# Altium project pca63550.PrjPCB
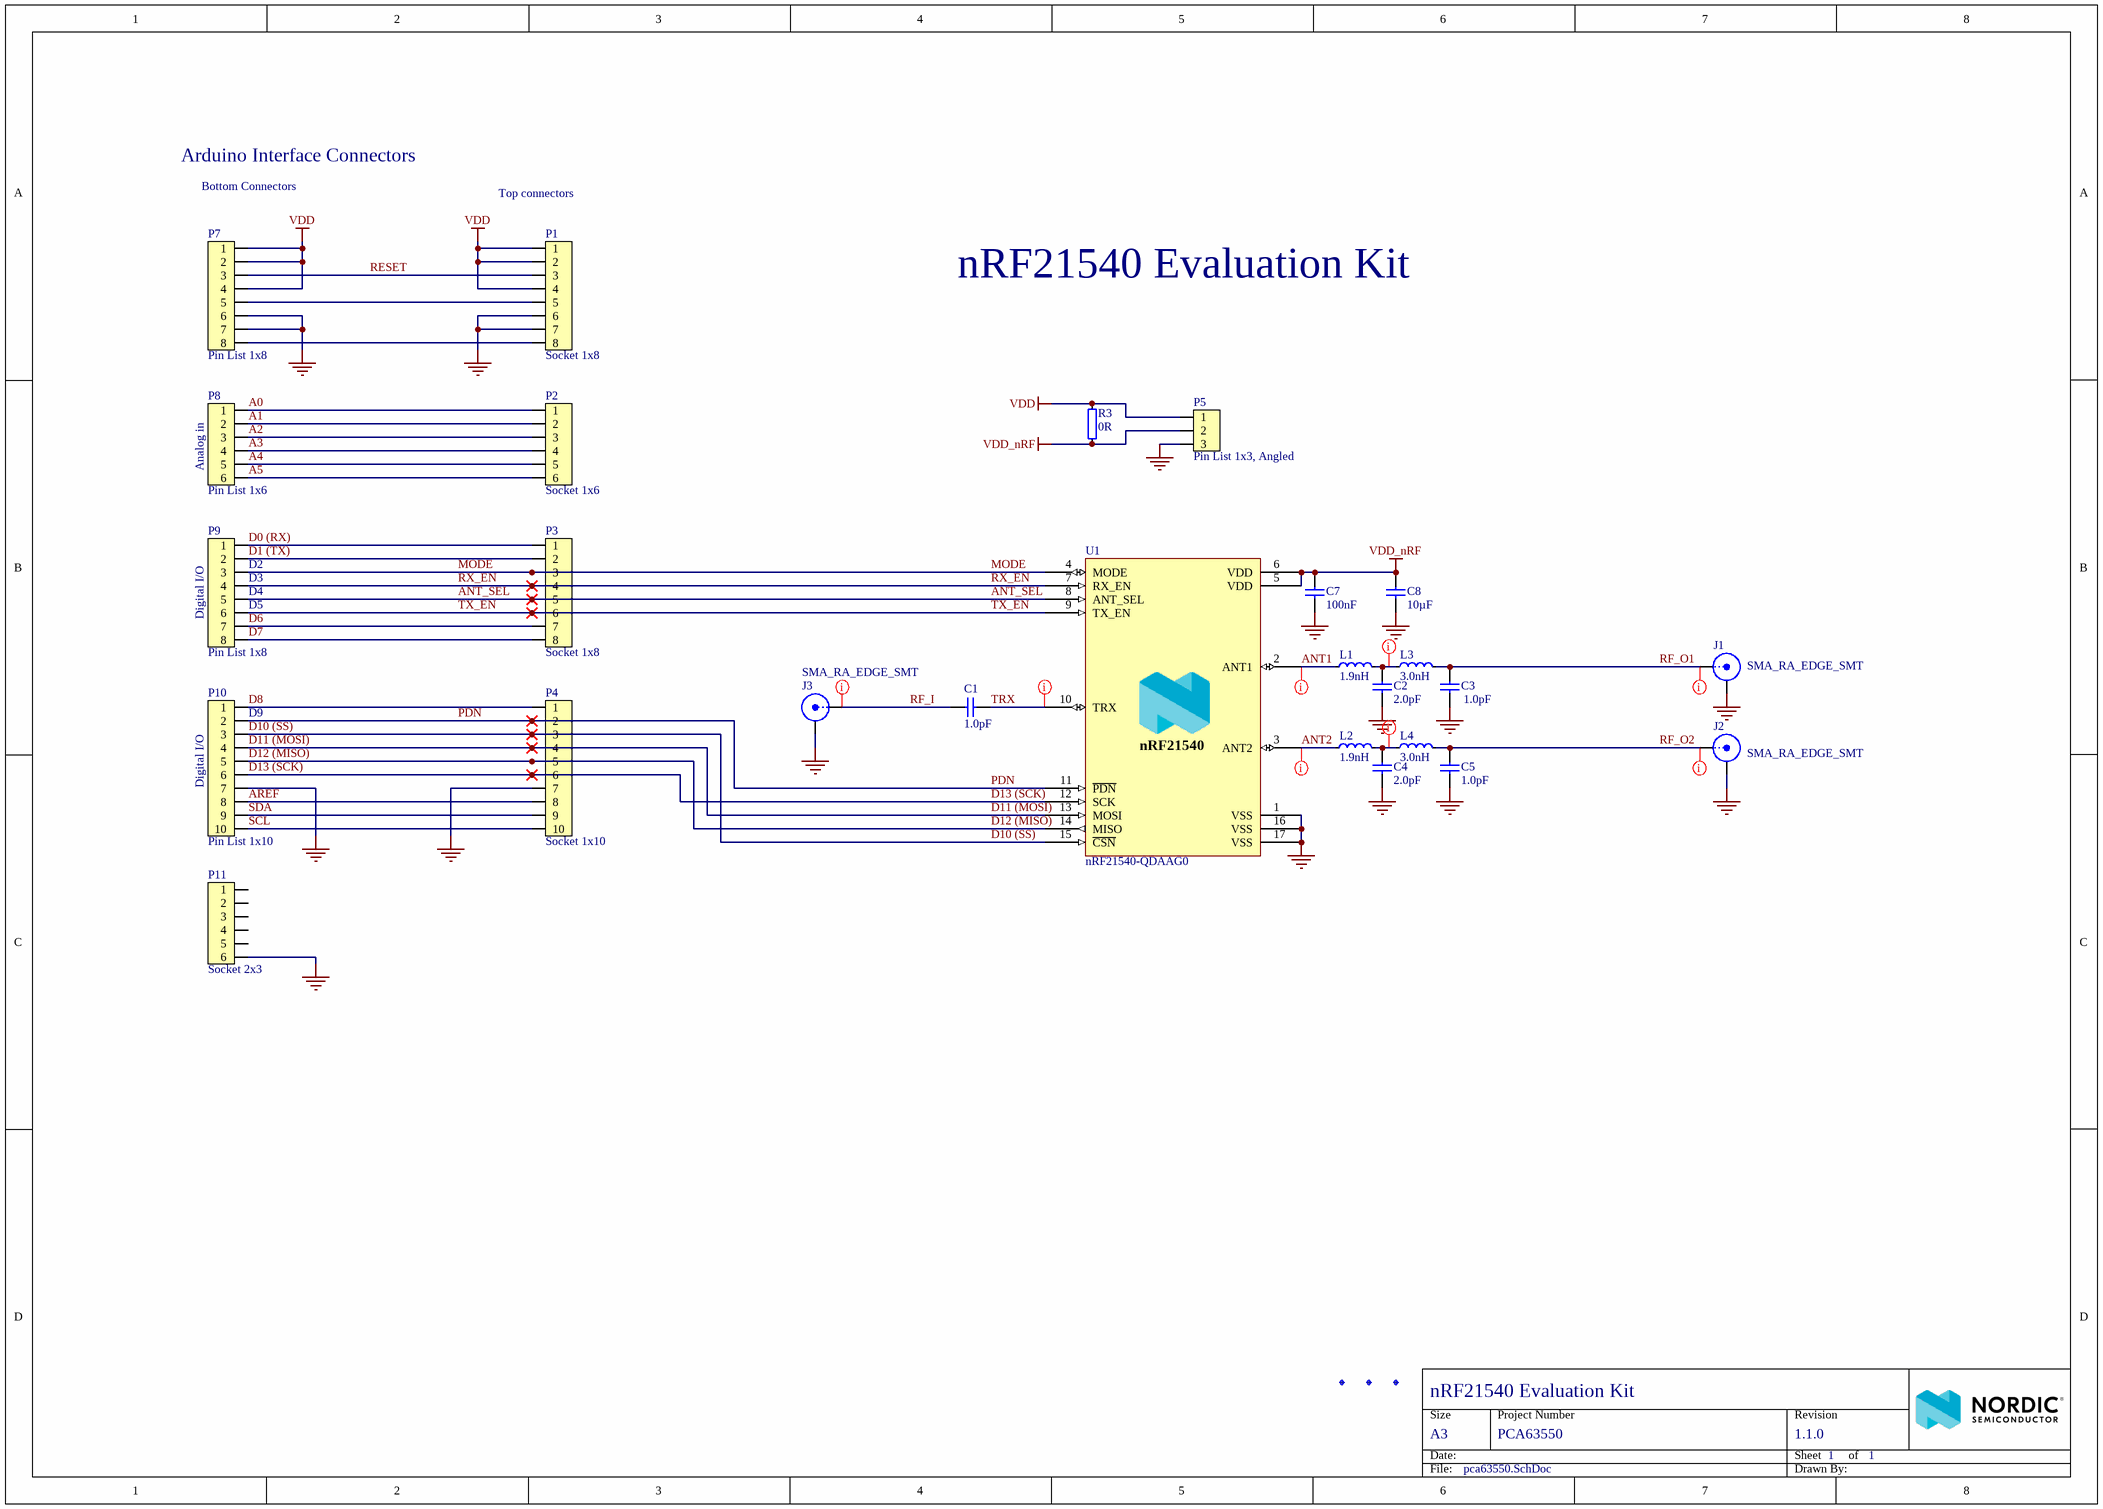
[diagram p0: pca63550.SchDoc]
Author: HANY; BoardThickness: 1.6mm; BoardTitle: nRF21540 Evaluation Kit; NrOfLayers: 4; Organization: Nordic Semiconductor; PCAName: PCA63550; PCBNumber: 400366; PCBRevision: 0027HANY; PCBStackup: 4001 - Free stackup; ProjectName: nRF21540; ProjectNumber: 4446; Revision: 1.1.0; SilkscreenColor: White; SoldermaskColor: Blue; SurfaceFinish: ENIG
1 sheet, 29 parts. Net scope: global (net labels, ports and power ports of the same name join across sheets).
Board file: 400366.PcbDoc

## Sheet pca63550.SchDoc: nRF21540 Evaluation Kit
size A3; Organization: Nordic Semiconductor; Revision: 1.1.0; SheetNumber: 1; SheetTotal: 1; Author: HANY; CompanyName: Nordic Semiconductor; DrawnBy: HANY; ProjectName: nRF21540

### Parts
C1  1.0pF  [CAPC0603X03L_C]
C2  2.0pF  [CAPC0603X03L_C]
C3  1.0pF  [CAPC0603X03L_C]
C4  2.0pF  [CAPC0603X03L_C]
C5  1.0pF  [CAPC0603X03L_C]
C7  100nF  [CAPC0603X03L_C]
C8  10µF  [CAPC1608X06L]
Fid1  Fiducial mark  [Fiducial]  (value not drawn)  (no BOM)
Fid2  Fiducial mark  [Fiducial]  (value not drawn)  (no BOM)
Fid3  Fiducial mark  [Fiducial]  (value not drawn)  (no BOM)
J1  Part Number: SMA_RA_EDGE_SMT  [SMA_2081005-1]  (hidden comment: SMA_2081005-1)
J2  Part Number: SMA_RA_EDGE_SMT  [SMA_2081005-1]  (hidden comment: SMA_2081005-1)
J3  Part Number: SMA_RA_EDGE_SMT  [SMA_2081005-1]  (hidden comment: SMA_2081005-1)
L1  1.9nH  [INDC0603X03L_C]
L2  1.9nH  [INDC0603X03L_C]
L3  3.0nH  [INDC0603X03L_C]
L4  3.0nH  [INDC0603X03L_C]
P1  Socket 1x8  [SOCKET_1x8_SMD]
P2  Socket 1x6  [SOCKET_1x6_SMD]
P3  Socket 1x8  [SOCKET_1x8_SMD]
P4  Socket 1x10  [SOCKET_1x10_SMD]
P5  Pin List 1x3, Angled  [LIST_ANG_1x3-SMD-2.54MM]
P7  Pin List 1x8  [LIST_1x8_SMD]
P8  Pin List 1x6  [LIST_1x6_SMD]
P9  Pin List 1x8  [LIST_1x8_SMD]
P10  Pin List 1x10  [LIST_1x10_SMD]
P11  Socket 2x3  [SOCKET_2x3_SMD-2.54mm-bottom]
R3  0R  [RESC1005X04L]
U1  nRF21540-QDAAG0  [QFN65P400X400X65_HS-17N]

### Nets
GND: C2.1 C3.1 C4.1 C5.1 C7.1 C8.1 J1.2(Y) J2.2(Y) J3.2(Y) P1.6 P1.7 P4.7 P5.3 P7.6 P7.7 P10.7 P11.6 U1.1(VSS) U1.16(VSS) U1.17(VSS)
VDD: P1.1 P1.2 P1.4 P5.1 P7.1 P7.2 P7.4 R3.2
VDD_nRF: C7.2 C8.2 P5.2 R3.1 U1.5(VDD) U1.6(VDD)
A0: P2.1 P8.1
A1: P2.2 P8.2
A2: P2.3 P8.3
A3: P2.4 P8.4
A4: P2.5 P8.5
A5: P2.6 P8.6
ANT1: L1.1 U1.2(ANT1)
ANT2: L2.1 U1.3(ANT2)
ANT_SEL: P3.5 P9.5 U1.8(ANT_SEL)
AREF: P4.8 P10.8
D0 (RX): P3.1 P9.1
D1 (TX): P3.2 P9.2
D6: P3.7 P9.7
D7: P3.8 P9.8
D8: P4.1 P10.1
D10 (SS): P4.3 P10.3 U1.15(~{CSN})
D11 (MOSI): P4.4 P10.4 U1.13(MOSI)
D12 (MISO): P4.5 P10.5 U1.14(MISO)
D13 (SCK): P4.6 P10.6 U1.12(SCK)
MODE: P3.3 P9.3 U1.4(MODE)
PDN: P4.2 P10.2 U1.11(~{PDN})
RESET: P1.3 P7.3
RF_I: C1.1 J3.1(X)
RF_O1: C3.2 J1.1(X) L3.2
RF_O2: C5.2 J2.1(X) L4.2
RX_EN: P3.4 P9.4 U1.7(RX_EN)
SCL: P4.10 P10.10
SDA: P4.9 P10.9
TRX: C1.2 U1.10(TRX)
TX_EN: P3.6 P9.6 U1.9(TX_EN)
NetC2_2: C2.2 L1.2 L3.1
NetC4_2: C4.2 L2.2 L4.1
NetP1_5: P1.5 P7.5
NetP1_8: P1.8 P7.8

Not connected (* = marked no-connect by the designer): P11 1 2 3 4 5

### Layout directives
net class Ant: ANT1, ANT2, NetC2_2, NetC4_2, RF_I, RF_O1, RF_O2, TRX

### Notes on the sheet
- Arduino Interface Connectors
- Bottom Connectors
- (near P1) Top connectors
- (near P8) Analog in
- (near P9) D2
- (near P9) D3
- (near P9) Digital I/O
- (near P9) D4
- (near P9) D5
- (near P10) D9
- (near P10) Digital I/O
- Size
- Date:
- A3
- Project Number
- Sheet         of
- Revision
- File:
- Drawn By:
- (in symbol nRF21540-QDAAG0) nRF21540

### Library data of the parts
C1 = C0201-1p0: Capacitor, C0G, ±0.1pF, 25V; Manufacturer: Murata; Manufacturer Part Number: GJM0335C1E1R0BB01D; Part number IPS: 00000007964; Artikkelnr Noca: N.A.; Pad Count: 2; Part Number: C0201-1p0; ComponentLink1URL: N.A.; ComponentLink1Description: Datasheet; ComponentLink2Description: Supplier link; HelpURL: http://search.murata.co.jp/Ceramy/image/img/A01X/G101/ENG/GJM0335C1E1R0BB01-01.pdf; Footprint Doc: 0201; LatestRevisionDate: 2020-10-13; Published: 2017-09-21; Value: 1.0pF; Note: ±0.1pF; ComponentLink2URL: N.A.; Supplier 1: Digi-Key; Supplier Part Number 1: 490-11172-1-ND; Supplier 2: N.A.; Supplier Part Number 2: N.A.; PartId: 100200398; Component Class: Capacitors; Author: rsk; Part number Norautron: N.A.
C2 C4 = C0201-2.0p-HQ-Murata: Capacitor, NP0, ±0.05pF, 25V; Manufacturer: Murata; Manufacturer Part Number: GJM0335C1E2R0WB01; Part number IPS: 00000001775; Artikkelnr Noca: N.A.; Pad Count: 2; Part Number: C0201-2.0p-HQ-Murata; ComponentLink1URL: N.A.; ComponentLink1Description: Datasheet; ComponentLink2URL: N.A.; ComponentLink2Description: Supplier link; HelpURL: https://psearch.en.murata.com/capacitor/product/GJM0335C1E2R0WB01%23.html; Footprint Doc: 0201; LatestRevisionDate: 2018-10-25; Published: 2018-10-25; Value: 2.0pF; Note: 25V; Supplier 1: N.A.; Supplier Part Number 1: N.A.; Supplier 2: N.A.; Supplier Part Number 2: N.A.; PartId: 100200419; Component Class: Capacitors; Author: rsk; Part number Norautron: N.A.
C3 C5 = C0201-1.0p_RF: RF Chip Cap 0201; Manufacturer: N.A.; Note: High frequency chip capasitors ±5%, NP0; Pad Count: 2; Part Number: C0201-1.0p_RF; Manufacturer Part Number: N.A.; ComponentLink1URL: N.A.; ComponentLink1Description: Datasheet; ComponentLink2URL: N.A.; ComponentLink2Description: Supplier link; HelpURL: N.A.; Footprint Doc: 0201; LatestRevisionDate: 2016-04-22; Published: 2016-04-22; Value: 1.0pF; Supplier 1: N.A.; Supplier Part Number 1: N.A.; Supplier 2: N.A.; Supplier Part Number 2: N.A.; Artikkelnr Noca: N.A.; Part number IPS: N.A.; PartId: 100200085; Component Class: Capacitors; Author: rsk; Part number Norautron: N.A.
C7 = C0201-100n: Capacitor, X5R, ±10%; Manufacturer: N.A.; Part number IPS: 00000001248, 00000002505; Note: 16V; Pad Count: 2; Part Number: C0201-100n; Manufacturer Part Number: N.A.; ComponentLink1URL: N.A.; ComponentLink1Description: Datasheet; ComponentLink2URL: N.A.; ComponentLink2Description: Supplier link; HelpURL: N.A.; Footprint Doc: 0201; LatestRevisionDate: 2017-11-09; Published: 2014-11-13; Value: 100nF; Artikkelnr Noca: N.A.; Supplier 1: N.A.; Supplier Part Number 1: N.A.; Supplier 2: N.A.; Supplier Part Number 2: N.A.; PartId: 100200078; Component Class: Capacitors; Author: rsk; Part number Norautron: N.A.
C8 = C0603-10µ: Capacitor, X5R, ±20%; Manufacturer: N.A.; Part number IPS: 00000007785; Note: 6.3V; Artikkelnr Noca: 20039234; Pad Count: 2; Part Number: C0603-10µ; Manufacturer Part Number: N.A.; ComponentLink1URL: N.A.; ComponentLink1Description: Datasheet; ComponentLink2URL: N.A.; ComponentLink2Description: Supplier link; HelpURL: N.A.; Footprint Doc: 0603; LatestRevisionDate: 2011-01-17; Published: 2011-01-17; Value: 10µF; Supplier 1: N.A.; Supplier Part Number 1: N.A.; Supplier 2: N.A.; Supplier Part Number 2: N.A.; PartId: 100200275; Component Class: Capacitors; Author: rsk; Part number Norautron: N.A.
Fid1-Fid3 = Fid-Mark: Manufacturer: N.A.; Value: N.A.; Pad Count: 1; Part Number: Fid-Mark; Manufacturer Part Number: N.A.; LatestRevisionDate: 2009-12-12; Published: 2009-12-12; Note: N.A.; Artikkelnr Noca: N.A.; Footprint Doc: Fiducial; ComponentLink1URL: N.A.; ComponentLink1Description: Datasheet; ComponentLink2URL: N.A.; ComponentLink2Description: Supplier link; HelpURL: N.A.; Part number IPS: N.A.; Supplier 1: N.A.; Supplier Part Number 1: N.A.; Supplier 2: N.A.; Supplier Part Number 2: N.A.; PartId: 100500073; Component Class: Connectors; Author: rsk; Part number Norautron: N.A.
J1-J3 = SMA_RA_EDGE_SMT: SMA, Female, Right Angle, TH/SMT, 50Ohm, Board Edge; Manufacturer: CompuPack; Manufacturer Part Number: ARFRBE22029-GGP; Part number IPS: 00000004905; Artikkelnr Noca: N.A.; Pad Count: 2; Value: SMA_2081005-1; Supplier 1: Cabcon; Supplier Part Number 1: C-Q1911001; ComponentLink1Description: Datasheet; ComponentLink1URL: N.A.; ComponentLink2Description: Supplier link; ComponentLink2URL: N.A.; Footprint Doc: SMA; HelpURL: N.A.; LatestRevisionDate: 2020-06-05; Published: 2020-06-05; PartId: 100500674; Component Class: Connectors; Author: rsk; Note: N.A.; Supplier 2: N.A.; Supplier Part Number 2: N.A.; Part number Norautron: N.A.
L1 L2 = L0201-1n9-HQ-Murata: Inductor, 600mA, ±0.1ｎH, 120mOhm; Manufacturer: Murata; Manufacturer Part Number: LQP03HQ1N9B02; Part number IPS: 00000004903; Note: -55°C ~ 125°C; Artikkelnr Noca: N.A.; Pad Count: 2; Part Number: L0201-1n9-HQ-Murata; ComponentLink1URL: https://search.murata.co.jp/Ceramy/image/img/P02/JELF243C-0021.pdf; ComponentLink1Description: Datasheet; ComponentLink2Description: Supplier link; HelpURL: https://psearch.en.murata.com/inductor/product/LQP03HQ1N9B02%23.html; Footprint Doc: 0201; LatestRevisionDate: 2018-10-23; Published: 2018-10-23; Value: 1.9nH; ComponentLink2URL: N.A.; Supplier 1: Digi-Key; Supplier Part Number 1: 490-13889-1-ND; Supplier 2: N.A.; Supplier Part Number 2: N.A.; PartId: 100300206; Component Class: Inductors; Author: rsk; Part number Norautron: N.A.
L3 L4 = L0201-3n0-HQ-Murata: Inductor, 600mA, ±0.1ｎH, 120mOhm; Manufacturer: Murata; Manufacturer Part Number: LQP03HQ3N0B02; Note: -55°C ~ 125°C; Artikkelnr Noca: N.A.; Pad Count: 2; Part Number: L0201-3n0-HQ-Murata; ComponentLink1URL: https://search.murata.co.jp/Ceramy/image/img/P02/JELF243C-0021.pdf; ComponentLink1Description: Datasheet; ComponentLink2Description: Supplier link; HelpURL: https://psearch.en.murata.com/inductor/product/LQP03HQ3N0B02%23.html; Footprint Doc: 0201; LatestRevisionDate: 2018-10-23; Published: 2018-10-23; Value: 3.0nH; Part number IPS: N.A.; ComponentLink2URL: N.A.; Supplier 1: Digi-Key; Supplier Part Number 1: 490-13915-1-ND; Supplier 2: N.A.; Supplier Part Number 2: N.A.; PartId: 100300217; Component Class: Inductors; Author: rsk; Part number Norautron: N.A.
P1 P3 = Socket 1x8 SMD: Socket 1x8, 2.54mm (100mil), SMD; Manufacturer: W-CON; Manufacturer Part Number: 2171-108MS0CUNR1; Part number IPS: 00000009963; Note: N.A.; Artikkelnr Noca: 55030002; Pad Count: 8; Part Number: Socket 1x8 SMD; LatestRevisionDate: 2017-10-23; Published: 2016-01-22; Value: Socket 1x8; Footprint Doc: SOCKET_1x8_SMD; ComponentLink1URL: N.A.; ComponentLink1Description: Datasheet; ComponentLink2URL: N.A.; ComponentLink2Description: Supplier link; HelpURL: N.A.; Supplier 1: Cabcon; Supplier Part Number 1: 2171-108MS0CUNR1; Supplier 2: Samtec; Supplier Part Number 2: SSM-108-F-SV-P-TR; PartId: 100500412; Component Class: Connectors; Author: rsk; Part number Norautron: N.A.
P2 = Socket 1x6 SMD: Socket 1x6, 2.54mm (100mil), SMD; Manufacturer: W-CON; Manufacturer Part Number: 2171-106MS0CUNR1; Part number IPS: 00000009964; Note: N.A.; Artikkelnr Noca: 55030001; Pad Count: 6; Part Number: Socket 1x6 SMD; LatestRevisionDate: 2017-10-23; Published: 2016-01-22; Value: Socket 1x6; Footprint Doc: SOCKET_1x6_SMD; ComponentLink1URL: N.A.; ComponentLink1Description: Datasheet; ComponentLink2URL: N.A.; ComponentLink2Description: Supplier link; HelpURL: N.A.; Supplier 1: Cabcon; Supplier Part Number 1: 2171-106MS0CUNR1; Supplier 2: Samtec; Supplier Part Number 2: SSM-106-F-SV-P-TR; PartId: 100500408; Component Class: Connectors; Author: rsk; Part number Norautron: N.A.
P4 = Socket 1x10 SMD: Socket 1x10, 2.54mm (100mil), SMD; Manufacturer: W-CON; Manufacturer Part Number: 2171-110MS0CUNR1; Part number IPS: 00000009965; Note: N.A.; Artikkelnr Noca: 55030004; Pad Count: 10; Part Number: Socket 1x10 SMD; LatestRevisionDate: 2016-01-22; Published: 2016-01-22; Value: Socket 1x10; Footprint Doc: SOCKET_1x10_SMD; ComponentLink1URL: N.A.; ComponentLink1Description: Datasheet; ComponentLink2URL: N.A.; ComponentLink2Description: Supplier link; HelpURL: N.A.; Supplier 1: Cabcon; Supplier Part Number 1: 2171-110MS0CUNR1; Supplier 2: Samtec; Supplier Part Number 2: SSM-110-F-SV-P-TR; PartId: 100500416; Component Class: Connectors; Author: rsk; Part number Norautron: N.A.
P5 = Pin List Ang 1x3 SMD, 2.54mm: Pin List 1x3, 2.54mm (100mil), Right Angled, SMD; Manufacturer: W-CON; Manufacturer Part Number: 1125B-1103S0Z135R2; Part number IPS: 00000009971; Note: N.A.; Artikkelnr Noca: 55010027; Pad Count: 3; Part Number: Pin List Ang 1x3 SMD, 2.54mm; Footprint Doc: LIST_ANG_1x3-SMD-2.54MM; LatestRevisionDate: 2016-05-26; Published: 2015-01-23; Value: Pin List 1x3, Angled; ComponentLink1URL: N.A.; ComponentLink1Description: Datasheet; ComponentLink2URL: N.A.; ComponentLink2Description: Supplier link; HelpURL: N.A.; Supplier 1: Cabcon; Supplier Part Number 1: 1125B-1103S0Z135R2; Supplier 2: Samtec; Supplier Part Number 2: TSM-103-01-L-SH-A; PartId: 100500356; Component Class: Connectors; Author: rsk; Part number Norautron: N.A.
P7 P9 = Pin List 1x8 SMD: Pin List 1x8, 2.54mm (100mil), SMD; Manufacturer: W-CON; Manufacturer Part Number: 1125-1108S0M116R2; Part number IPS: 00000001701; Note: N.A.; Artikkelnr Noca: 55010006; Pad Count: 8; Part Number: Pin List 1x8 SMD; LatestRevisionDate: 2016-01-22; Published: 2016-01-22; Value: Pin List 1x8; Footprint Doc: LIST_1x8_SMD; ComponentLink1URL: N.A.; ComponentLink1Description: Datasheet; ComponentLink2URL: N.A.; ComponentLink2Description: Supplier link; HelpURL: \\hizz\pro\app9717\Datasheet\connectors\W-CON\1125-11XXXXMXXXXX.pdf; Supplier 1: Cabcon; Supplier Part Number 1: 1125-1108S0M116R2; Supplier 2: Samtec; Supplier Part Number 2: TSM-108-01-L-SV-P-TR; PartId: 100500329; Component Class: Connectors; Author: rsk; Part number Norautron: N.A.
P8 = Pin List 1x6 SMD: Pin List 1x6, 2.54mm (100mil), SMD; Manufacturer: W-CON; Manufacturer Part Number: 1125-1106S0M116R2; Note: N.A.; Artikkelnr Noca: 55010026; Pad Count: 6; Part Number: Pin List 1x6 SMD; LatestRevisionDate: 2016-03-29; Published: 2016-03-29; Value: Pin List 1x6; Footprint Doc: LIST_1x6_SMD; ComponentLink1URL: N.A.; ComponentLink1Description: Datasheet; ComponentLink2URL: N.A.; ComponentLink2Description: Supplier link; HelpURL: \\hizz\pro\app9717\Datasheet\connectors\W-CON\1125-11XXXXMXXXXX.pdf; Part number IPS: N.A.; Supplier 1: Cabcon; Supplier Part Number 1: 1125-1106S0M116R2; Supplier 2: Samtec; Supplier Part Number 2: TSM-106-01-L-SV-P-TR; PartId: 100500320; Component Class: Connectors; Author: rsk; Part number Norautron: N.A.
P10 = Pin List 1x10 SMD: Pin List 1x10, 2.54mm (100mil), SMD; Manufacturer: W-CON; Manufacturer Part Number: 1125-1110S0M116R2; Part number IPS: 00000004906; Note: N.A.; Artikkelnr Noca: 55010028; Pad Count: 10; Part Number: Pin List 1x10 SMD; LatestRevisionDate: 2016-03-29; Published: 2016-03-29; Value: Pin List 1x10; Footprint Doc: LIST_1x10_SMD; ComponentLink1URL: N.A.; ComponentLink1Description: Datasheet; ComponentLink2URL: N.A.; ComponentLink2Description: Supplier link; HelpURL: \\hizz\pro\app9717\Datasheet\connectors\W-CON\1125-11XXXXMXXXXX.pdf; Supplier 1: Cabcon; Supplier Part Number 1: 1125-1110S0M116R2; Supplier 2: Samtec; Supplier Part Number 2: TSM-110-01-L-SV-P-TR; PartId: 100500337; Component Class: Connectors; Author: rsk; Part number Norautron: N.A.
P11 = Socket 2x3 SMD Bottom: Socket 2x3, 2.54mm (100mil), SMD; Manufacturer: W-CON; Manufacturer Part Number: 2171-203MS0CUNR1; Part number IPS: 00000004907; Note: N.A.; Artikkelnr Noca: 55030010; Pad Count: 6; Part Number: Socket 2x3 SMD Bottom; LatestRevisionDate: 2016-03-29; Published: 2014-06-10; Value: Socket 2x3; Footprint Doc: SOCKET_2x3_SMD-2.54mm-bottom; ComponentLink1URL: N.A.; ComponentLink1Description: Datasheet; ComponentLink2URL: N.A.; ComponentLink2Description: Supplier link; HelpURL: \\hizz\pro\app9717\Datasheet\connectors\W-CON\2171-2XXMXXCUNXX.pdf; Supplier 1: Cabcon; Supplier Part Number 1: 2171-203MS0CUNR1; Supplier 2: Samtec; Supplier Part Number 2: SSM-103-F-DV-P-TR; PartId: 100500433; Component Class: Connectors; Author: rsk; Part number Norautron: N.A.
R3 = R0402-0R: Resistor, ±5%, 0.063W; Manufacturer: N.A.; Part number IPS: 00000007128; Note: Chip Res 5%; Artikkelnr Noca: 27049000; Pad Count: 2; Part Number: R0402-0R; Manufacturer Part Number: N.A.; LatestRevisionDate: 2009-11-23; Published: 2009-05-08; Value: 0R; Footprint Doc: 0402; ComponentLink1URL: N.A.; ComponentLink1Description: Datasheet; ComponentLink2URL: N.A.; ComponentLink2Description: Supplier link; HelpURL: N.A.; Supplier 1: Farnell; Supplier Part Number 1: 146-9661; Supplier 2: N.A.; Supplier Part Number 2: N.A.; PartId: 100100109; Component Class: Resistors; Author: rsk; Part number Norautron: N.A.
U1 = nRF21540-QDAAG0: Radio front-end / range extender for 2.4GHz; Manufacturer: Nordic Semiconductor; Note: N.A.; Pad Count: 16; Part Number: nRF21540-QDAAG0; Manufacturer Part Number: nRF21540-QDAAG0; ComponentLink1URL: N.A.; ComponentLink1Description: Datasheet; ComponentLink2URL: N.A.; ComponentLink2Description: Supplier link; HelpURL: N.A.; Footprint Doc: QFN-16; LatestRevisionDate: 2021-03-24; Published: 2021-03-24; Value: nRF21540-QDAAG0; Artikkelnr Noca: N.A.; Part number IPS: N.A.; Supplier 1: Nordic Semiconductor; Supplier Part Number 1: nRF21540-QDAAG0; Supplier 2: N.A.; Supplier Part Number 2: N.A.; PartId: 102000223; Component Class: nRF_Devices; Author: hany; Part number Norautron: N.A.

## Assembly variants
Default Variant: not fitted P1 P2 P3 P4 P8 P12 P13 Sh1 Sh2 Sh3 Sh4 Sh5 Sh6